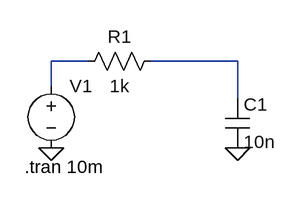
[diagram p0: schematic Draft3.1.asc]
Draft3.1.asc, the LTspice schematic file:
Version 4
SHEET 1 880 680
WIRE 128 128 80 128
WIRE 320 128 208 128
WIRE 80 160 80 128
WIRE 320 176 320 128
FLAG 80 240 0
FLAG 320 240 0
SYMBOL res 224 112 R90
WINDOW 0 0 56 VBottom 2
WINDOW 3 32 56 VTop 2
SYMATTR InstName R1
SYMATTR Value 1k
SYMBOL cap 304 176 R0
SYMATTR InstName C1
SYMATTR Value 10n
SYMBOL voltage 80 144 R0
WINDOW 3 24 96 Invisible 2
WINDOW 123 0 0 Left 2
WINDOW 39 0 0 Left 2
SYMATTR InstName V1
SYMATTR Value PULSE(-1 1 1ps 1ps 1ps 0.25m 0.5m 10)
TEXT 46 264 Left 2 !.tran 10m

The netlist it stands for:
* Draft3.1.asc
R1 N002 N001 1k
C1 N002 0 10n
V1 N001 0 PULSE(-1 1 1ps 1ps 1ps 0.25m 0.5m 10)
.tran 10m
.backanno
.end